# EAGLE schematic latchbox-lite (EAGLE 6.6.0)
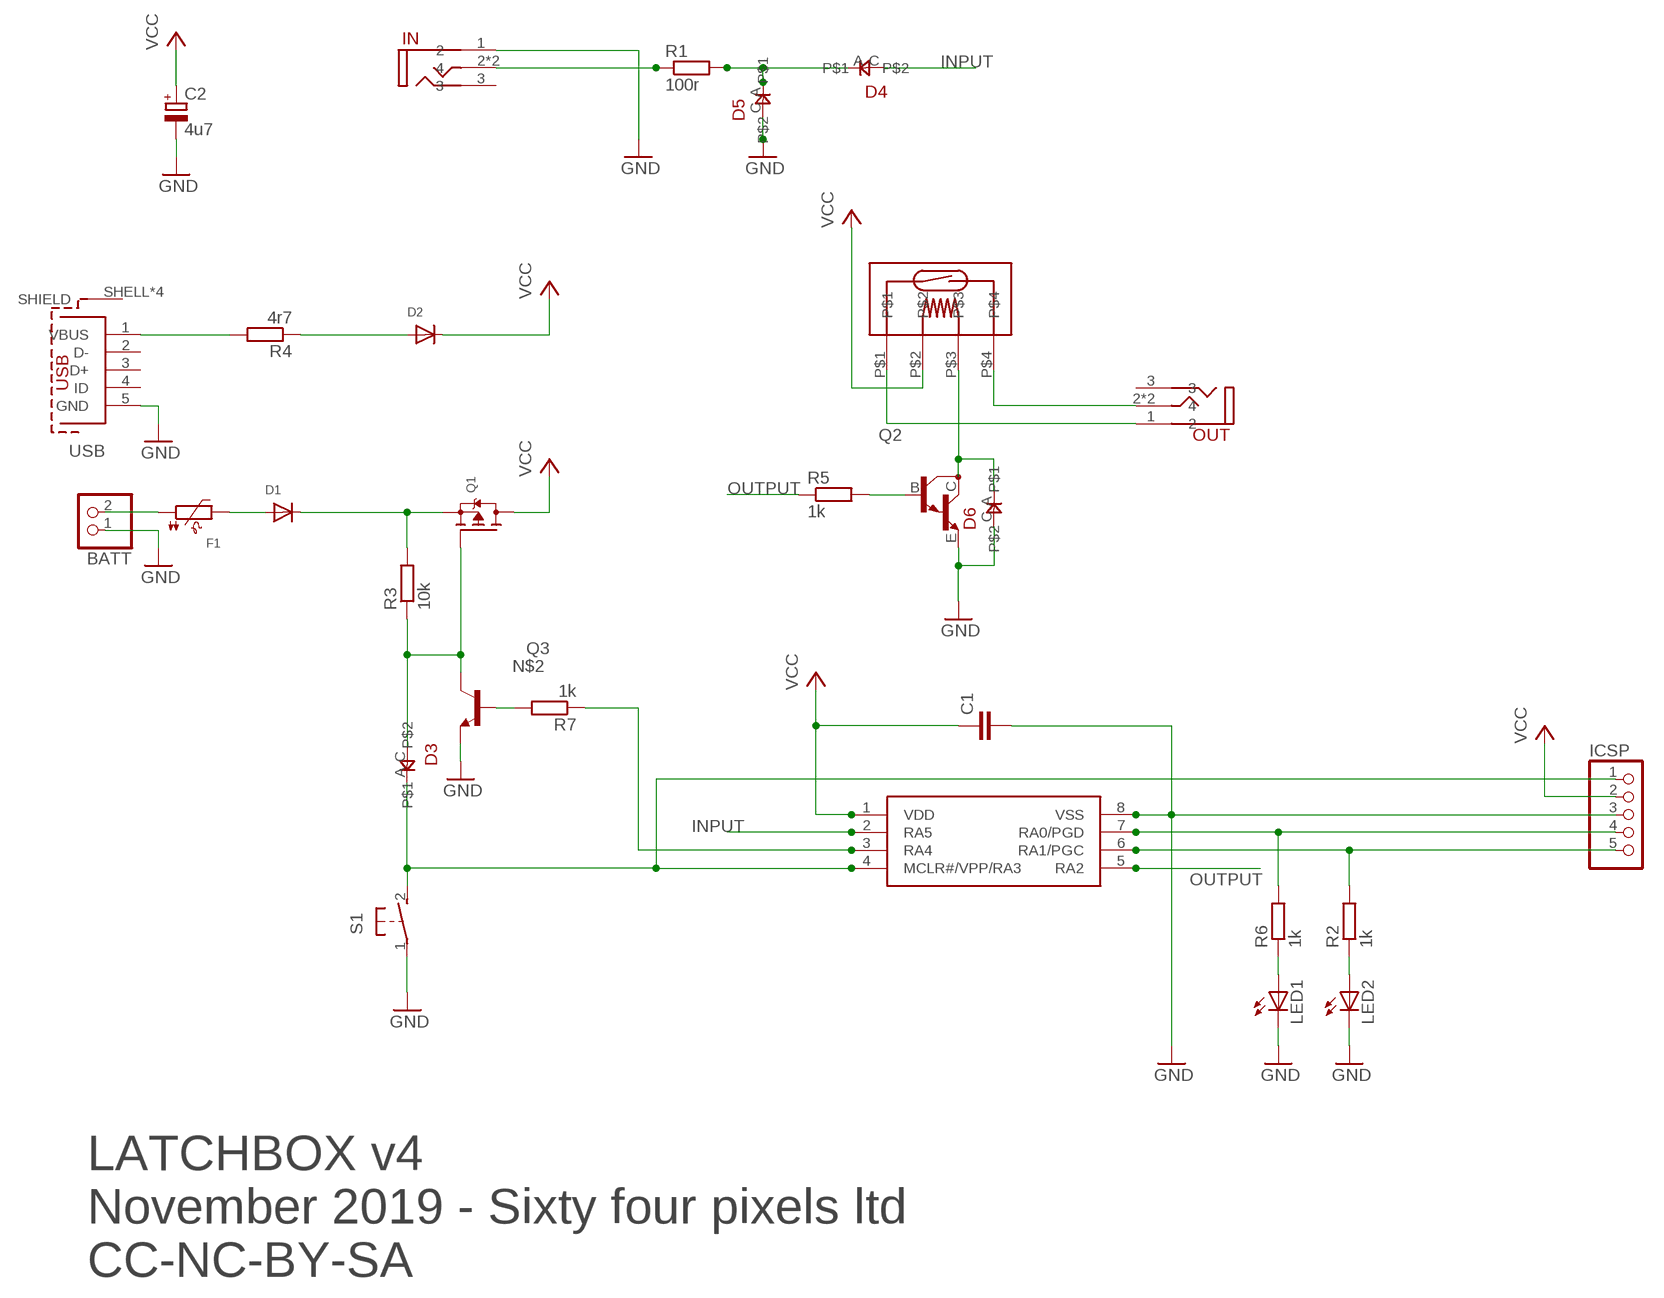
[diagram p0: schematic, sheet 1]

## Parts
BATT  PINHD-1X2  [1X02]
C1  C-EUC0805  [C0805]
C2  4u7  CPOL-EUE2,5-6E  [E2,5-6E]
D1  DIODESOD-123  [SOD-123]
D2  DIODESOD-123  [SOD-123]
D3  0805DIODE  [0805DIODE]
D4  0805DIODE  [0805DIODE]
D5  0805DIODE  [0805DIODE]
D6  0805DIODE  [0805DIODE]
F1  PTC1206  [1206]
IC1  PIC12F1822SO08  [SO08]
ICSP  PINHD-1X5  [1X05]
IN  3_5MM_PTH_MICRO  [3_5MM_PTH_MICRO]
LED1  LED3MM  [LED3MM]
LED2  LED3MM  [LED3MM]
OUT  3_5MM_PTH_MICRO  [3_5MM_PTH_MICRO]
Q1  MOSFET-P  [SOT23-R]
Q2  MMBTA13LT1-NPN_DARL-SOT23-BEC  [SOT23-BEC]
Q3  MMBT3904LT1-NPN-SOT23-BEC  [SOT23-BEC]
R1  100r  R-EU_R0805  [R0805]
R2  1k  R-EU_R0805  [R0805]
R3  10k  R-EU_R0805  [R0805]
R4  4r7  R-EU_R0805  [R0805]
R5  1k  R-EU_R0805  [R0805]
R6  1k  R-EU_R0805  [R0805]
R7  1k  R-EU_R0805  [R0805]
RLY1  9007-REED-RELAY  [9007-REED-RELAY]
S1  31-XX  [B3F-31XX]
USB  629105150521  [629105150521]

## Nets
GND: BATT.1 C1.2 C2.- D5.C D6.C IC1.8(VSS) ICSP.3 IN.1 LED1.K(C) LED2.K(C) Q2.E Q3.E S1.1(P) USB.5(GND)
INPUT: D4.C IC1.2(RA5)
N$1: IN.2 IN.2A R1.1
N$2: D3.C Q1.1(G) Q3.C R3.1
N$3: LED2.A R2.1
N$4: D1.C Q1.2(S) R3.2
N$5: BATT.2 F1.1
N$6: Q2.B R5.2
N$7: OUT.2 OUT.2A RLY1.P$4
N$8: OUT.1 RLY1.P$1
N$9: D6.A Q2.C RLY1.P$3
N$10: LED1.A R6.1
N$11: IC1.7(RA0/PGD) ICSP.4 R6.2
N$12: IC1.6(RA1/PGC) ICSP.5 R2.2
N$13: Q3.B R7.2
N$14: D3.A IC1.4(MCLR#/VPP/RA3) ICSP.1 S1.2(S)
N$15: D1.A F1.2
N$16: R4.2 USB.1(VBUS)
OUTPUT: IC1.5(RA2) R5.1
POWER_CTRL: IC1.3(RA4) R7.1
USB_POWER: D2.A R4.1
VCC: C1.1 C2.+ D2.C IC1.1(VDD) ICSP.2 Q1.3(D) RLY1.P$2
Z: D4.A D5.A R1.2
Unconnected: IN.3 OUT.3 USB.2(D-) USB.3(D+) USB.4(ID) USB.SHELL1(SHIELD) USB.SHELL2(SHIELD) USB.SHELL3(SHIELD) USB.SHELL(SHIELD)

## Notes on the sheet
- LATCHBOX v4
- November 2019 - Sixty four pixels ltd
- CC-NC-BY-SA

## Library data of the parts
BATT = pinhead:PINHD-1X2: PIN HEADER
C1 = rcl:C-EU: CAPACITOR, European symbol
C2 = rcl:CPOL-EU: POLARIZED CAPACITOR, European symbol
D1 D2 = microbuilder:DIODE: Diode SMADIODE - SMA Surface Mount Package 20V 1A Schottky Diode Digikey (500mV @ 1A, 500uA Vr @ 20V): 641-1014-6-ND 10V 2A Schottky Diode Digikey (350mV @ 2A, 700uA Vr @ 10V): MBRA210LT3 SOD-123 30V 200mA (800mV Vf, 2uA Vr @ 25V) Schottky Diode (very fast switching for boost, etc.) - Digikey: BAT54T1GOSTR-ND 30V 500mA (430mV Vf, 130uA Vr @ 30V) Schottky Diode - Digikey: B0530W-FDICT-ND MBR120 1A 20V (0.34Vf) Schottky Diode - Digikey: MBR120VLSFT1GOSCT-ND SOD-323 10V 570mA (380mV Vf, 3ns) Schottky Diode - Digikey: ZLLS410CT-ND 1N4148WS - 75V 150mA (1V Vf @ 10mA, 4ns) Simple Diode - Digikey: 1N4148WSFSCT-ND, Mouser: 512-1N4148WS SOD-523 BAT54 30V 200mA Schottky (0.8 Vf @ 100mA, 5ns) - Digikey: BAT54XV2CT-ND 30V 30mA Schottky Diode (RB751S-40TE61) - Digikey: RB751S-40TE61CT-ND SOT23-R/W - SOT23 Package (R = Solder Paste/Reflow Ovens, W = Hand-Soldering) BAT54Film 40V 300mA - Digikey: 497-7162-1-ND DO-1N4148 Through Hole Small Current Diode (any model)
D3-D6 = jasons_stuff:0805DIODE
F1 = microbuilder:PTC: PTC (Resettable Fuse) 1206 Package 250mA PTC (16V Max, Time-to-Trip: 0.08s) - Digikey: F2110CT-ND 1210 Package 100mA PTC (30V Max, Time-to-Trip: 0.6s) - Digikey: MF-USMF010-2CT-ND 1812 Package 750mA PTC (24V Max, Time-to-Trip: 0.2s) - Digikey: MF-MSMF075/24-2CT-ND
IC1 = jasons_stuff:PIC12F1822
ICSP = pinhead:PINHD-1X5: PIN HEADER
IN OUT = jason_eagle6:3_5MM_PTH_MICRO
LED1 LED2 = led:LED: LED OSRAM: - CHIPLED LG R971, LG N971, LY N971, LG Q971, LY Q971, LO R971, LY R971 LH N974, LH R974 LS Q976, LO Q976, LY Q976 LO Q996 - Hyper CHIPLED LW Q18S LB Q993, LB Q99A, LB R99A - SideLED LS A670, LO A670, LY A670, LG A670, LP A670 LB A673, LV A673, LT A673, LW A673 LH A674 LY A675 LS A676, LA A676, LO A676, LY A676, LW A676 LS A679, LY A679, LG A679 - Hyper Micro SIDELED® LS Y876, LA Y876, LO Y876, LY Y876 LT Y87S - SmartLED LW L88C, LW L88S LB L89C, LB L89S, LG L890 LS L89K, LO L89K, LY L89K LS L896, LA L896, LO L896, LY L896 - TOPLED LS T670, LO T670, LY T670, LG T670, LP T670 LSG T670, LSP T670, LSY T670, LOP T670, LYG T670 LG T671, LOG T671, LSG T671 LB T673, LV T673, LT T673, LW T673 LH T674 LS T676, LA T676, LO T676, LY T676, LB T676, LH T676, LSB T676, LW T676 LB T67C, LV T67C, LT T67C, LS T67K, LO T67K, LY T67K, LW E67C LS E67B, LA E67B, LO E67B, LY E67B, LB E67C, LV E67C, LT E67C LW T67C LS T679, LY T679, LG T679 LS T770, LO T770, LY T770, LG T770, LP T770 LB T773, LV T773, LT T773, LW T773 LH T774 LS E675, LA E675, LY E675, LS T675 LS T776, LA T776, LO T776, LY T776, LB T776 LHGB T686 LT T68C, LB T68C - Hyper Mini TOPLED® LB M676 - Mini TOPLED Santana® LG M470 LS M47K, LO M47K, LY M47K Source: http://www.osram.convergy.de LUXEON: - LUMILED® LXK2-PW12-R00, LXK2-PW12-S00, LXK2-PW14-U00, LXK2-PW14-V00 LXK2-PM12-R00, LXK2-PM12-S00, LXK2-PM14-U00 LXK2-PE12-Q00, LXK2-PE12-R00, LXK2-PE12-S00, LXK2-PE14-T00, LXK2-PE14-U00 LXK2-PB12-K00, LXK2-PB12-L00, LXK2-PB12-M00, LXK2-PB14-N00, LXK2-PB14-P00, LXK2-PB14-Q00 LXK2-PR12-L00, LXK2-PR12-M00, LXK2-PR14-Q00, LXK2-PR14-R00 LXK2-PD12-Q00, LXK2-PD12-R00, LXK2-PD12-S00 LXK2-PH12-R00, LXK2-PH12-S00 LXK2-PL12-P00, LXK2-PL12-Q00, LXK2-PL12-R00 Source: www.luxeon.com KINGBRIGHT: KA-3528ASYC Source: www.kingbright.com
Q1 = microbuilder:MOSFET-P: P-Channel Mosfet SOT-23 IRLML5103 30V 760mA 1V Vgs - Digikey: IRLML5103PBFCT-ND NTR0202PL 20V 400mA 2.3V Vgs - Digikey: NTR0202PLT1GOSTR-ND NTR4101PT1G 20V 1.8A 1.2V Vgs - Digikey: NTR4101PT1GOSCT-ND DMP2004K 20V 600mA 1V Vgs - Digikey: DMP2004KDICT-ND
Q2 = transistor:*-NPN_DARL-: NPN Darlington Transistor
Q3 = transistor:*-NPN-: NPN Transistror BF959 corrected 2008.03.06
R1-R7 = rcl:R-EU_: RESISTOR, European symbol
RLY1 = jason_eagle6:9007-REED-RELAY
S1 = switch-omron:31-XX: OMRON SWITCH; MPN: B3F-3100; OC_FARNELL: 959704; OC_NEWARK: 36M3582
USB = jason_eagle6:629105150521: WR-COM_USB_Micro Type B_Horizontal_SMT ; Micro Type B Horizontal SMT - 3A current at Pin1 & Pin 5 - with Pegs and THT shielding Pins - T&R Packaging Code : Con_I-O_COM_USB_2.0_B_629105150521_629105150521 <http://katalog.we-online.de/media/images/eican/Con_I-O_COM_USB_2.0_B_629105150521_pf2.jpg> Details see: http://katalog.we-online.de/em/datasheet/629105150521.pdf Created 12/08/2014, Dan Xu 2014 (C) Wurth Elektronik